# Altium schematic sheet Bf706 DSP.SchDoc
size A4; SheetNumber: 1; SheetTotal: 5
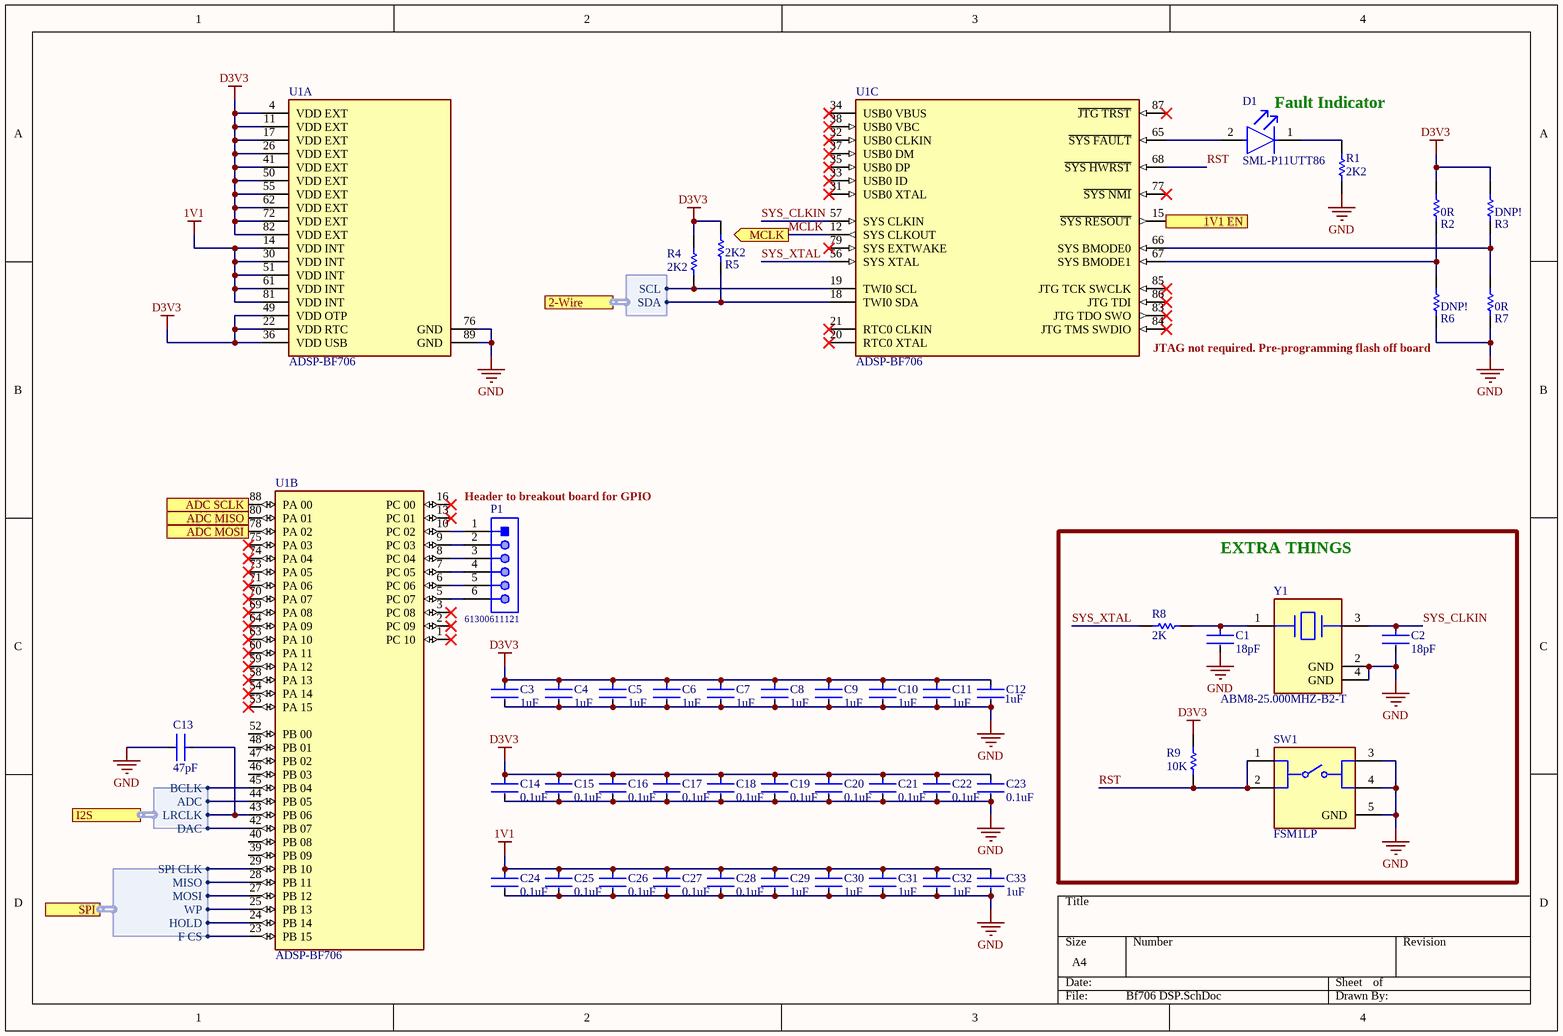
[diagram p0: Bf706 DSP.SchDoc]

## Parts
C1  18pF  [FP-GRM15-MFG]
C2  18pF  [FP-GRM15-MFG]
C3  1uF  [FP-GRM15-MFG]
C4  1uF  [FP-GRM15-MFG]
C5  1uF  [FP-GRM15-MFG]
C6  1uF  [FP-GRM15-MFG]
C7  1uF  [FP-GRM15-MFG]
C8  1uF  [FP-GRM15-MFG]
C9  1uF  [FP-GRM15-MFG]
C10  1uF  [FP-GRM15-MFG]
C11  1uF  [FP-GRM15-MFG]
C12  1uF  [FP-GRM15-MFG]
C13  47pF  [FP-GRM15-MFG]
C14  0.1uF  [FP-GRM15-MFG]
C15  0.1uF  [FP-GRM15-MFG]
C16  0.1uF  [FP-GRM15-MFG]
C17  0.1uF  [FP-GRM15-MFG]
C18  0.1uF  [FP-GRM15-MFG]
C19  0.1uF  [FP-GRM15-MFG]
C20  0.1uF  [FP-GRM15-MFG]
C21  0.1uF  [FP-GRM15-MFG]
C22  0.1uF  [FP-GRM15-MFG]
C23  0.1uF  [FP-GRM15-MFG]
C24  0.1uF  [FP-GRM15-MFG]
C25  0.1uF  [FP-GRM15-MFG]
C26  0.1uF  [FP-GRM15-MFG]
C27  0.1uF  [FP-GRM15-MFG]
C28  0.1uF  [FP-GRM15-MFG]
C29  1uF  [FP-GRM15-MFG]
C30  1uF  [FP-GRM15-MFG]
C31  1uF  [FP-GRM15-MFG]
C32  1uF  [FP-GRM15-MFG]
C33  1uF  [FP-GRM15-MFG]
D1  SML-P11UTT86  [FP-SML-P11UTT86-MFG]
P1  61300611121  [61300611121]
R1  2K2  [RESC1005X40X25LL05T05]
R2  0R  [RESC1005X40X25LL05T05]
R3  DNP!  [RESC1005X40X25LL05T05]
R4  2K2  [RESC1005X40X25LL05T05]
R5  2K2  [RESC1005X40X25LL05T05]
R6  DNP!  [RESC1005X40X25LL05T05]
R7  0R  [RESC1005X40X25LL05T05]
R8  2K  [RESC1005X40X25LL05T05]
R9  10K  [RESC1005X40X25LL05T05]
SW1  FSM1LP  [FP-FSM1LP-MFG]
U1  ADSP-BF706  [FP-CP-88-8-IPC_C]  (parts A,B,C of 3)
Y1  ABM8-25.000MHZ-B2-T  [FP-ABM8-MFG]

## Blocks framed on the sheet
EXTRA THINGS: C1 C2 R8 R9 SW1 Y1

## Ports
1V1 EN (out), 2-Wire (harness Two Wire), ADC MISO (in), ADC MOSI (out), ADC SCLK (out), I2S (harness I2S), MCLK (out), SPI (harness SPI)

## Harnesses
Two Wire: SCL, SDA
I2S: BCLK, ADC, LRCLK, DAC
SPI: SPI CLK, MISO, MOSI, WP, HOLD, F CS

## Nets
1V1: C24.2 C25.2 C26.2 C27.2 C28.2 C29.2 C30.2 C31.2 C32.2 C33.2 U1.14(VDD_INT) U1.30(VDD_INT) U1.51(VDD_INT) U1.61(VDD_INT) U1.81(VDD_INT)
D3V3: C3.2 C4.2 C5.2 C6.2 C7.2 C8.2 C9.2 C10.2 C11.2 C12.2 C14.2 C15.2 C16.2 C17.2 C18.2 C19.2 C20.2 C21.2 C22.2 C23.2 R2.2 R3.2 R4.2 R5.2 R9.2 U1.4(VDD_EXT) U1.11(VDD_EXT) U1.17(VDD_EXT) U1.22(VDD_RTC) U1.26(VDD_EXT) U1.36(VDD_USB) U1.41(VDD_EXT) U1.49(VDD_OTP) U1.50(VDD_EXT) U1.55(VDD_EXT) U1.62(VDD_EXT) U1.72(VDD_EXT) U1.82(VDD_EXT)
GND: C1.1 C2.1 C3.1 C4.1 C5.1 C6.1 C7.1 C8.1 C9.1 C10.1 C11.1 C12.1 C13.1 C14.1 C15.1 C16.1 C17.1 C18.1 C19.1 C20.1 C21.1 C22.1 C23.1 C24.1 C25.1 C26.1 C27.1 C28.1 C29.1 C30.1 C31.1 C32.1 C33.1 R1.1 R6.1 R7.1 SW1.3 SW1.4 SW1.5(GND) U1.76(GND) U1.89(GND) Y1.2(GND) Y1.4(GND)
1V1 EN: U1.15(~{SYS_RESOUT}) ; port 1V1 EN
ADC MISO: U1.80(PA_01) ; port ADC MISO
ADC MOSI: U1.78(PA_02) ; port ADC MOSI
ADC SCLK: U1.88(PA_00) ; port ADC SCLK
MCLK: U1.12(SYS_CLKOUT) ; port MCLK
RST: R9.1 SW1.1 SW1.2 U1.68(~{SYS_HWRST})
SYS_CLKIN: C2.2 U1.57(SYS_CLKIN) Y1.3
SYS_XTAL: R8.2 U1.56(SYS_XTAL)
NetC1_2: C1.2 R8.1 Y1.1
NetC13_2: C13.2 U1.43(PB_06) ; port I2S.LRCLK
NetD1_1: D1.1(C) R1.2
NetD1_2: D1.2(A) U1.65(~{SYS_FAULT})
NetP1_1: P1.1 U1.10(PC_02)
NetP1_2: P1.2 U1.9(PC_03)
NetP1_3: P1.3 U1.8(PC_04)
NetP1_4: P1.4 U1.7(PC_05)
NetP1_5: P1.5 U1.6(PC_06)
NetP1_6: P1.6 U1.5(PC_07)
NetR2_1: R2.1 R6.2 U1.67(SYS_BMODE1)
NetR3_1: R3.1 R7.2 U1.66(SYS_BMODE0)
NetR4_1: R4.1 U1.19(TWI0_SCL) ; port 2-Wire.SCL
NetR5_1: R5.1 U1.18(TWI0_SDA) ; port 2-Wire.SDA
NetU1_23: U1.23(PB_15) ; port SPI.F CS
NetU1_24: U1.24(PB_14) ; port SPI.HOLD
NetU1_25: U1.25(PB_13) ; port SPI.WP
NetU1_27: U1.27(PB_12) ; port SPI.MOSI
NetU1_28: U1.28(PB_11) ; port SPI.MISO
NetU1_29: U1.29(PB_10) ; port SPI.SPI CLK
NetU1_42: U1.42(PB_07) ; port I2S.DAC
NetU1_44: U1.44(PB_05) ; port I2S.ADC
NetU1_45: U1.45(PB_04) ; port I2S.BCLK

Not connected (* = marked no-connect by the designer): U1 1(PC_10)* 2(PC_09)* 3(PC_08)* 13(PC_01)* 16(PC_00)* 20(RTC0_XTAL)* 21(RTC0_CLKIN)* 31(USB0_XTAL)* 32(USB0_CLKIN)* 33(USB0_ID)* 34(USB0_VBUS)* 35(USB0_DP)* 37(USB0_DM)* 38(USB0_VBC)* 39(PB_09) 40(PB_08) 46(PB_03) 47(PB_02) 48(PB_01) 52(PB_00) 53(PA_15)* 54(PA_14)* 58(PA_13)* 59(PA_12)* 60(PA_11)* 63(PA_10)* 64(PA_09)* 69(PA_08)* 70(PA_07)* 71(PA_06)* 73(PA_05)* 74(PA_04)* 75(PA_03)* 77(~{SYS_NMI})* 79(SYS_EXTWAKE)* 83(JTG_TDO_SWO)* 84(JTG_TMS_SWDIO)* 85(JTG_TCK_SWCLK)* 86(JTG_TDI)* 87(~{JTG_TRST})*

## Notes on the sheet
- Fault Indicator
- (near U1) JTAG not required. Pre-programming flash off board
- Header to breakout board for GPIO

## Library data of the parts
C1-C33 = CMP-2100-03641-2: CAP CER 0.1UF 16V X7R 0402; Manufacturer Part Number: GRM155R71C104KA88D; Manufacturer: Murata; Standoff Height: 0mm; Tolerance: 10%; Voltage Rating: 16Vdc; Material: Ceramic; Capacitance: 0.10μF; Value: 0.10μF; RoHS: TRUE; Temperature Characteristic: X7R; Octopart: https://octopart.com/grm155r71c104ka88d-murata-196880; Digikey Description: CAP CER 0.1UF 16V X7R 0402; Device Class L3: Ceramic Capacitors; Height: 0.55mm; ComponentLink2Description: Datasheet; Temperature Range Low: -55°C; Ipc Land Pattern Name: CAPC10050X219; ComponentLink2URL: https://search.murata.co.jp/Ceramy/image/img/A01X/G101/ENG/GRM155R71H471KA01-01A.pdf; Device Class L1: Passive Components; Lead Free: yes; Category: Cap; Package: GRM15; Temperature: -55°C to +125°C; Device Class L2: Capacitors; Temperature Range High: +125°C; Mouser Description: 0402 0.1 uF 16V ±10 % Tolerance X7R SMT Multilayer Ceramic Capacitor
D1 = CMP-08952-000028-1: LED RED CLEAR 1006 SMD; Number of LEDs: 1; Lens Color: Colorless; Viewing Angle: 150°; Dominant Wavelength: 621nm; Luminous Intensity: 5.5mcd; Forward Voltage: 1.8V; Lens Style: Square; Test Current: 1mA; Forward Current: 20mA; Height: 0.25mm; Radiation Hardening: No; Color: Red; Case Code (Metric): 1005; Number of Pins: 2; RoHS Compliant: Yes; Max Operating Temperature: 85°C; Package Quantity: 1; Wavelength: 621nm; Lens Transparency: Clear; Packaging: Tape and Reel; Lead Free: Lead Free; Illumination Color: Red; Case/Package: 0402; Case Code (Imperial): 0402; Mount: Surface Mount; Min Operating Temperature: -40°C; Width: 0.6mm; Length: 1mm; Series: PicoLED™; REACH SVHC: No SVHC
P1 = CMP-1502-01070-1: THT Vertical Pin Header WR-PHD, Pitch 2.54 mm, Single Row, 6 pins; Manufacturer: Wurth Elektronik; Gender: Male; Pin Number: 6; Pitch: 2.54mm; Working Voltage: 250VAC; Rated Current: 3A; Withstanding Voltage: 500VAC; Contact Resistance: 20mOhm; Operating Temperature: -40to105degC; Packaging: Bag; Datasheet URL: https://katalog.we-online.de/em/datasheet/6130xx11121.pdf; Package Reference: 61300611121; Mounting Technology: THT; Publisher: WurthElektronik; Part Number: 61300611121; Manufacturer URL: http://www.we-online.de; Row Number: Single; Orientation: Vertical
R1-R9 = CMP-2000-07451-1: Chip Resistor, 0 Ohm, 0.1 W, -55 to 155 degC, 0402 (1005 Metric), RoHS, Tape and Reel; Manufacturer: Panasonic; Voltage Rating (DC): 50V; Temperature Coefficient: 600ppm/��C; Max Power Dissipation: 100mW; Resistance: 0mOhm; Tolerance: 5%; Number of Terminations: 2; Mount: SurfaceMount; Height: 0.35mm; Packaging: TapeandReel; Contact Plating: Tin; Manufacturer URL: http://www.panasonic.com/; Composition: ThickFilm; Max Operating Temperature: 155degC; REACH SVHC: NoSVHC; Case/Package: 0402; Package Reference: 402; Depth: 0.5mm; Package Description: 2-Pin Surface Mount Device, Body 1 x 0.5 mm; Datasheet URL: https://industrial.panasonic.com/cdbs/www-data/pdf/RDA0000/AOA0000C301.pdf; RoHSCompliant: True; Case Code (Imperial): 0402; Military Standard: Not; Min Operating Temperature: -55degC; Power Rating: 100mW; Datasheet Version: 03/2015; Length: 1mm; Case Code (Metric): 1005; Termination: SMD/SMT; Mounting Technology: SurfaceMount; Voltage Rating: 50V; Width: 0.02inch; Package Quantity: 1; Lead Free: LeadFree; Radiation Hardening: No
SW1 = CMP-03402-000015-1: SWITCH TACTILE SPST-NO 0.05A 24V; Electrical Life: 100000Cycles; Actuator Type: Standard; Contact Resistance: 100mR; Current Rating: 50mA; Operating Force: 1.57N; Actuator Material: Polyphthalamide; Illumination Type: Non-Illuminated; Actuator Length: 0.01inch; Voltage Rating (DC): 12V; Throw Configuration: SPST; Switch Travel: 0.25mm; Switch Function: Off-Mom; Actuator Color: Black; Length: 6.19mm; Min Operating Temperature: -35°C; Contact Material: Copper Alloy; Max Current Rating: 50mA; Max Operating Temperature: 85°C; Packaging: Loose Piece; Lead Free: Lead Free; Mount: Surface Mount; RoHS Compliant: Yes; Orientation: Straight; Package Quantity: 2000; Mechanical Life: 100000Cycles; Type: Switch; ELV: Compliant; Depth: 8mm; Contact Plating: Silver; Max Voltage Rating (DC): 12V; REACH SVHC: No SVHC; Series: FSM1LP; Contact Current Rating: 50mA; Termination: Gull Wing
U1 = CMP-09089-000022-1: IC DSP LP 128KB L2SR 88LFCSP; Frequency: 200MHz; Interface: I2C; Memory Size: 512KB; Number of Pins: 88; Min Operating Temperature: -40°C; Mount: Surface Mount; RoHS Compliant: Yes; Max Operating Temperature: 85°C; Lead Free: Contains Lead; Packaging: Tray; Max Frequency: 200MHz; RAM Size: 128KB
Y1 = CMP-27762-013668-1: Crystal 25MHz ±20ppm 18pF SMD-4 3.2mm x 2.5mm; ESR (Equivalent Series Resistance): 50R; Frequency Stability: 50ppm; Max Operating Temperature: 70°C; Operating Frequency: 25 MHz; Mount: Surface Mount; Case/Package: CSMD; Termination: SMD/SMT; Frequency: 25MHz; Frequency Tolerance: 20ppm; Load Capacitance: 18pF; Height: 0.031inch; Lead Free: Lead Free; Min Operating Temperature: -20°C; Depth: 2.5mm; Length: 3.2mm; Resistor Type: Ceramic; Series Resistance: 50R; Radiation Hardening: No; Series: ABM8; Width: 0.098inch; Number of Pins: 4; Package Quantity: 1000; Tolerance: 20ppm; Packaging: Tape and Reel; REACH SVHC: No SVHC